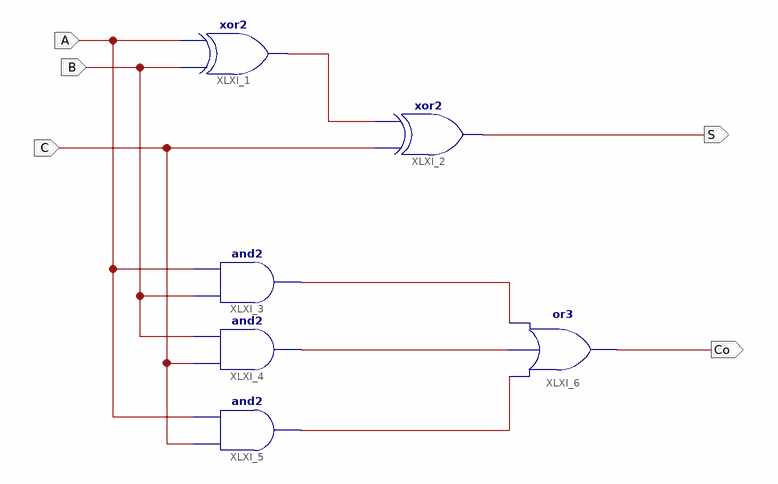
[diagram p0: schematic sheet 1]
// Xilinx ISE schematic Adder1b.sch (kintex7) as structural Verilog: 6 symbols, 5 ports
module Adder1b (
  input  A,
  input  B,
  input  C,
  output S,
  output Co
);

  wire XLXN_3, XLXN_14, XLXN_15, XLXN_16;

  xor XLXI_1 (XLXN_3, B, A);
  xor XLXI_2 (S, C, XLXN_3);
  and XLXI_3 (XLXN_15, B, A);
  and XLXI_4 (XLXN_14, C, B);
  and XLXI_5 (XLXN_16, C, A);
  or XLXI_6 (Co, XLXN_16, XLXN_14, XLXN_15);
endmodule
